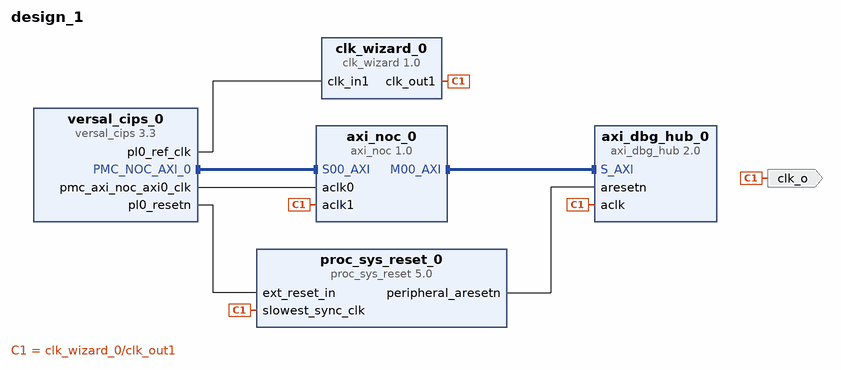
[diagram p0: block diagram of the top level]
# Vivado block design design_1, xcvm1802-vsva2197-2MP-e-S, Vivado 2022.2
create_bd_design design_1

create_bd_port -dir O -type clk clk_o

create_bd_cell -type ip -vlnv xilinx.com:ip:versal_cips:3.3 versal_cips_0
set_property -dict [list \
  CONFIG.BOOT_MODE Custom \
  CONFIG.CLOCK_MODE {REF CLK 33.33 MHz} \
  CONFIG.DDR_MEMORY_MODE Enable \
  CONFIG.DEBUG_MODE JTAG \
  CONFIG.DESIGN_MODE 0 \
  CONFIG.DEVICE_INTEGRITY_MODE {Sysmon temperature voltage and external IO monitoring} \
  CONFIG.PS_PMC_CONFIG {['BOOT_MODE Custom', 'CLOCK_MODE {REF CLK 33.33 MHz}', 'DDR_MEMORY_MODE {Connectivity to DDR via NOC}', 'DEBUG_MODE JTAG', 'DESIGN_MODE 0', 'DEVICE_INTEGRITY_MODE {Sysmon temperature voltage and external IO monitoring}', 'PMC_ALT_REF_CLK_FREQMHZ 33.333', 'PMC_CRP_EFUSE_REF_CTRL_SRCSEL IRO_CLK/4', 'PMC_CRP_HSM0_REF_CTRL_FREQMHZ 33.333', 'PMC_CRP_HSM1_REF_CTRL_FREQMHZ 133.333', 'PMC_CRP_LSBUS_REF_CTRL_FREQMHZ 100', 'PMC_CRP_NOC_REF_CTRL_FREQMHZ 960', 'PMC_CRP_PL0_REF_CTRL_FREQMHZ 100', 'PMC_CRP_PL5_REF_CTRL_FREQMHZ 400', 'PMC_PL_ALT_REF_CLK_FREQMHZ 33.333', 'PMC_QSPI_FBCLK {{ENABLE 0} {IO {PMC_MIO 6}}}', 'PMC_QSPI_PERIPHERAL_ENABLE 1', 'PMC_SD0 {{CD_ENABLE 0} {CD_IO {PMC_MIO 24}} {POW_ENABLE 0} {POW_IO {PMC_MIO 17}} {RESET_ENABLE 0} {RESET_IO {PMC_MIO 17}} {WP_ENABLE 0} {WP_IO {PMC_MIO 25}}}', 'PMC_SD0_PERIPHERAL {{CLK_100_SDR_OTAP_DLY 0x00} {CLK_200_SDR_OTAP_DLY 0x00} {CLK_50_DDR_ITAP_DLY 0x00} {CLK_50_DDR_OTAP_DLY 0x00} {CLK_50_SDR_ITAP_DLY 0x2C} {CLK_50_SDR_OTAP_DLY 0x4} {ENABLE 1} {IO {PMC_MIO 13 .. 25}}}', 'PMC_SD0_SLOT_TYPE {SD 2.0}', 'PMC_SMAP_PERIPHERAL {{ENABLE 0} {IO {32 Bit}}}', 'PMC_USE_PMC_NOC_AXI0 1', 'PS_BOARD_INTERFACE Custom', 'PS_HSDP_EGRESS_TRAFFIC JTAG', 'PS_HSDP_INGRESS_TRAFFIC JTAG', 'PS_HSDP_MODE None', 'PS_NUM_FABRIC_RESETS 1', 'PS_USE_FPD_CCI_NOC 0', 'PS_USE_FPD_CCI_NOC0 0', 'PS_USE_NOC_LPD_AXI0 0', 'PS_USE_PMCPL_CLK0 1', 'PS_USE_PMCPL_IRO_CLK 1', 'SMON_ALARMS Set_Alarms_On', 'SMON_ENABLE_TEMP_AVERAGING 0', 'SMON_MEAS33 {{ALARM_ENABLE 1} {ALARM_LOWER 0.00} {ALARM_UPPER 2.00} {AVERAGE_EN 0} {ENABLE 1} {MODE {2 V unipolar}} {NAME VCCAUX} {SUPPLY_NUM 0}}', 'SMON_MEAS34 {{ALARM_ENABLE 1} {ALARM_LOWER 0.00} {ALARM_UPPER 2.00} {AVERAGE_EN 0} {ENABLE 1} {MODE {2 V unipolar}} {NAME VCCAUX_PMC} {SUPPLY_NUM 1}}', 'SMON_MEAS56 {{ALARM_ENABLE 1} {ALARM_LOWER 0.00} {ALARM_UPPER 2.00} {AVERAGE_EN 0} {ENABLE 1} {MODE {2 V unipolar}} {NAME VCC_PMC} {SUPPLY_NUM 2}}', 'SMON_MEAS57 {{ALARM_ENABLE 1} {ALARM_LOWER 0.00} {ALARM_UPPER 2.00} {AVERAGE_EN 0} {ENABLE 1} {MODE {2 V unipolar}} {NAME VCC_PSFP} {SUPPLY_NUM 3}}', 'SMON_MEAS58 {{ALARM_ENABLE 1} {ALARM_LOWER 0.00} {ALARM_UPPER 2.00} {AVERAGE_EN 0} {ENABLE 1} {MODE {2 V unipolar}} {NAME VCC_PSLP} {SUPPLY_NUM 4}}', 'SMON_MEAS60 {{ALARM_ENABLE 1} {ALARM_LOWER 0.00} {ALARM_UPPER 2.00} {AVERAGE_EN 0} {ENABLE 1} {MODE {2 V unipolar}} {NAME VCC_SOC} {SUPPLY_NUM 5}}', 'SMON_MEAS61 {{ALARM_ENABLE 1} {ALARM_LOWER 0.00} {ALARM_UPPER 2.00} {AVERAGE_EN 0} {ENABLE 1} {MODE {2 V unipolar}} {NAME VP_VN} {SUPPLY_NUM 6}}', 'SMON_TEMP_AVERAGING_SAMPLES 0']} \
] [get_bd_cells versal_cips_0]
create_bd_cell -type ip -vlnv xilinx.com:ip:axi_noc:1.0 axi_noc_0
set_property -dict {CONFIG.MI_SIDEBAND_PINS 0 CONFIG.NUM_CLKS 2} [get_bd_cells axi_noc_0]
create_bd_cell -type ip -vlnv xilinx.com:ip:clk_wizard:1.0 clk_wizard_0
create_bd_cell -type ip -vlnv xilinx.com:ip:proc_sys_reset:5.0 proc_sys_reset_0
create_bd_cell -type ip -vlnv xilinx.com:ip:axi_dbg_hub:2.0 axi_dbg_hub_0

# ---- connections ----

connect_bd_intf_net [get_bd_intf_pins axi_dbg_hub_0/S_AXI] [get_bd_intf_pins axi_noc_0/M00_AXI]
connect_bd_intf_net [get_bd_intf_pins versal_cips_0/PMC_NOC_AXI_0] [get_bd_intf_pins axi_noc_0/S00_AXI]
connect_bd_net [get_bd_pins clk_wizard_0/clk_out1] \
  [get_bd_pins axi_dbg_hub_0/aclk] [get_bd_pins proc_sys_reset_0/slowest_sync_clk] [get_bd_pins axi_noc_0/aclk1] \
  [get_bd_ports clk_o]
connect_bd_net [get_bd_pins proc_sys_reset_0/peripheral_aresetn] [get_bd_pins axi_dbg_hub_0/aresetn]
connect_bd_net [get_bd_pins versal_cips_0/pl0_ref_clk] [get_bd_pins clk_wizard_0/clk_in1]
connect_bd_net [get_bd_pins versal_cips_0/pl0_resetn] [get_bd_pins proc_sys_reset_0/ext_reset_in]
connect_bd_net [get_bd_pins versal_cips_0/pmc_axi_noc_axi0_clk] [get_bd_pins axi_noc_0/aclk0]

# ---- address map ----
assign_bd_address -offset 0x0000020100000000 -range 2M -target_address_space [get_bd_addr_spaces versal_cips_0/PMC_NOC_AXI_0] [get_bd_addr_segs axi_dbg_hub_0/S_AXI_DBG_HUB/Mem0]

validate_bd_design
save_bd_design
